# EAGLE design TurrisClock (EAGLE 7.1.0)
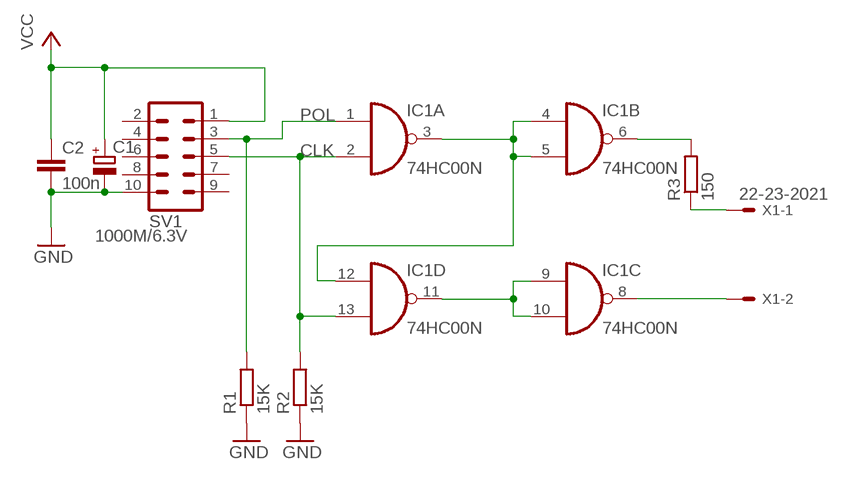
[diagram p0: schematic, sheet 1]

## Parts
C1  1000M/6.3V  CPOL-EUE5-8.5  [E5-8,5]
C2  100n  C-EU050-024X044  [C050-024X044]
IC1  74HC00N  [DIL14]
R1  15K  R-EU_0204/7  [0204/7]
R2  15K  R-EU_0204/7  [0204/7]
R3  150  R-EU_0204/7  [0204/7]
SV1  ML10  [ML10]
X1  22-23-2021  [22-23-2021]

## Nets
CLK: IC1.2(A:I1) IC1.13(D:I1) R2.2 SV1.5
GND: C1.- C2.2 R1.1 R2.1 SV1.10
N$1: IC1.3(A:O) IC1.4(B:I0) IC1.5(B:I1) IC1.12(D:I0)
N$2: IC1.9(C:I0) IC1.10(C:I1) IC1.11(D:O)
N$3: IC1.6(B:O) R3.2
N$4: IC1.8(C:O) X1.2
N$5: R3.1 X1.1
POL: IC1.1(A:I0) R1.2 SV1.3
VCC: C1.+ C2.1 SV1.1
Unconnected: SV1.2 SV1.4 SV1.6 SV1.7 SV1.8 SV1.9

## Power pins joined to a net without a drawn wire
GND: IC1.7(P:GND)
VCC: IC1.14(P:VCC)

## Library data of the parts
C1 = rcl:CPOL-EU: POLARIZED CAPACITOR, European symbol
C2 = rcl:C-EU: CAPACITOR, European symbol
IC1 = 74xx-eu:74*00: Quad 2-input NAND gate
R1-R3 = rcl:R-EU_: RESISTOR, European symbol
SV1 = con-ml:ML10: HARTING; OC_FARNELL: unknown; OC_NEWARK: unknown
X1 = con-molex:22-23-2021: .100" (2.54mm) Center Header - 2 Pin; MF: MOLEX; MPN: 22-23-2021; OC_FARNELL: 1462926; OC_NEWARK: 25C3832

## Board
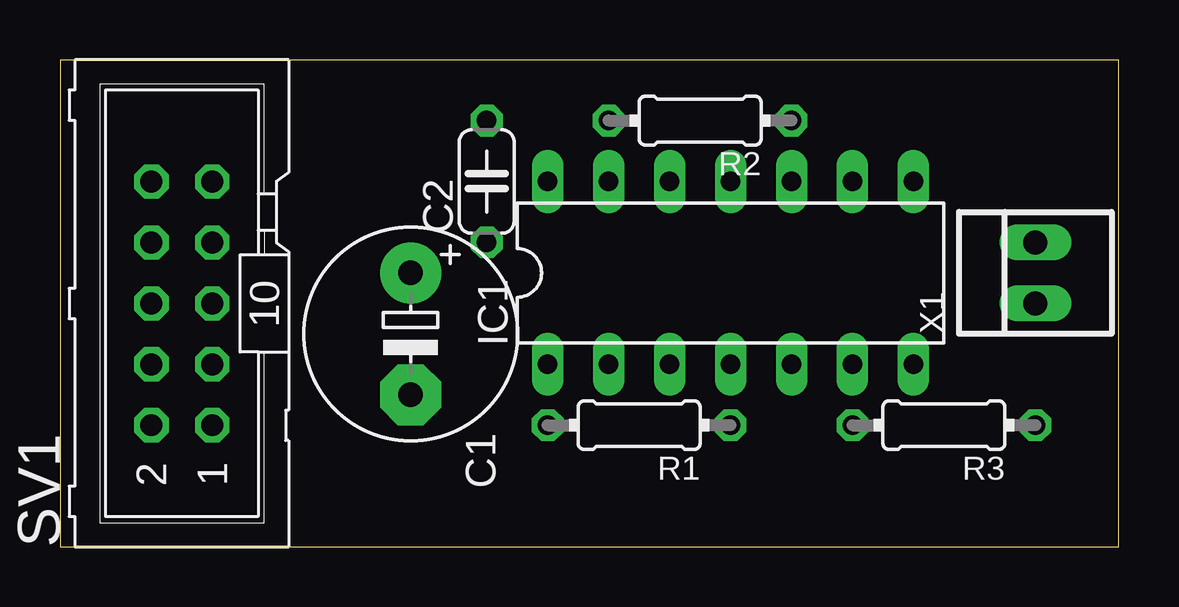
[diagram p1: board, top side]
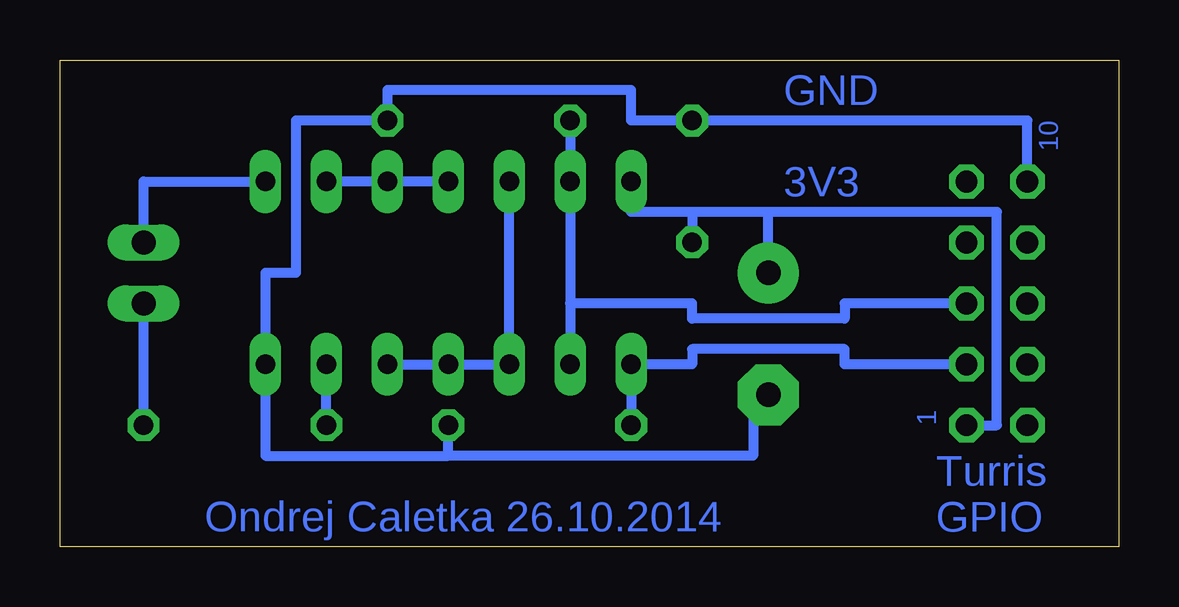
[diagram p2: board, bottom side, seen from below]

Size 44.12 x 20.31 mm. Coordinates in mm from the lower left corner, seen from the top.
Outline: 0,0 44.12,0 44.12,20.31 0,20.31 0,0
Copper layers (1*16): Top 0.035mm / dielectric 1.5mm / Bottom 0.035mm
Design rules "default": minimum track width 10mil, minimum drill 24mil, track to track 8mil, track to pad 8mil, pad to pad 8mil, via to via 8mil, smd to smd 8mil, copper to edge 40mil, drill to drill 8mil, minimum pad ring 10mil, minimum via ring 8mil, stop-mask expansion 4mil, vias tented up to drill 0mil, thermal gap 10mil

### Footprints (pad centres in the part's own frame; a part is rotated, then mirrored left to right if it is on the bottom)
E5-8,5 = drill 1.016 pad 2.54: + -2.54,0 | drill 1.016 pad 2.54 octagon: - 2.54,0
C050-024X044 = drill 0.813 octagon: 1 -2.54,0; 2 2.54,0
DIL14 = drill 0.813 long: 1 -7.62,-3.81; 2 -5.08,-3.81; 3 -2.54,-3.81; 4 0,-3.81; 5 2.54,-3.81; 6 5.08,-3.81; 7 7.62,-3.81; 8 7.62,3.81; 9 5.08,3.81; 10 2.54,3.81; 11 0,3.81; 12 -2.54,3.81; 13 -5.08,3.81; 14 -7.62,3.81
0204/7 = drill 0.813 octagon: 1 -3.81,0; 2 3.81,0
ML10 = drill 0.914 octagon: 1 -5.08,-1.27; 2 -5.08,1.27; 3 -2.54,-1.27; 4 -2.54,1.27; 5 0,-1.27; 6 0,1.27; 7 2.54,-1.27; 8 2.54,1.27; 9 5.08,-1.27; 10 5.08,1.27
22-23-2021 = drill 1 long: 1 -1.27,0; 2 1.27,0

### Placement (x,y rotation side)
C1  14.61,8.89 270 top
C2  17.78,15.24 90 top
IC1  27.94,11.43 0 top
R1  24.13,5.08 180 top
R2  26.67,17.78 180 top
R3  36.83,5.08 180 top
SV1  5.08,10.16 90 top
X1  40.64,11.43 90 top

### Tracks (layer width: path | path; a pad name or v marks a point on that pad's centre or on a via)
CLK
  Bottom 0.406: 22.86,10.16 IC1.13 R2.2 | 22.86,10.16 IC1.2 | SV1.5 11.43,10.16 11.43,9.53 17.78,9.53 17.78,10.16 22.86,10.16
GND
  Bottom 0.406: C1.- 15.24,6.35 15.24,3.81 27.94,3.81 | 27.94,3.81 R1.1 | SV1.10 3.81,17.78 C2.2 20.32,17.78 20.32,19.05 30.48,19.05 R2.1 34.29,17.78 34.29,11.43 35.56,11.43 IC1.7 35.56,3.81 27.94,3.81
N$1
  Bottom 0.406: IC1.5 IC1.4 IC1.3 IC1.12
N$2
  Bottom 0.406: IC1.11 IC1.10 IC1.9
N$3
  Bottom 0.406: R3.2 IC1.6
N$4
  Bottom 0.406: X1.2 40.64,15.24 IC1.8
N$5
  Bottom 0.406: R3.1 X1.1
POL
  Bottom 0.406: SV1.3 11.43,7.62 11.43,8.26 17.78,8.26 17.78,7.62 IC1.1 R1.2
VCC
  Bottom 0.406: 14.61,13.97 17.78,13.97 | 17.78,13.97 C2.1 | 17.78,13.97 20.32,13.97 IC1.14 | C1.+ 14.61,13.97 | SV1.1 5.08,5.08 5.08,13.97 14.61,13.97

### Text on the board
Bottom: GND | 10 | 3V3 | 1 | Turris / GPIO | Ondrej Caletka 26.10.2014